# EAGLE schematic Z05_CC_SHIELD_02 (EAGLE 6.3)
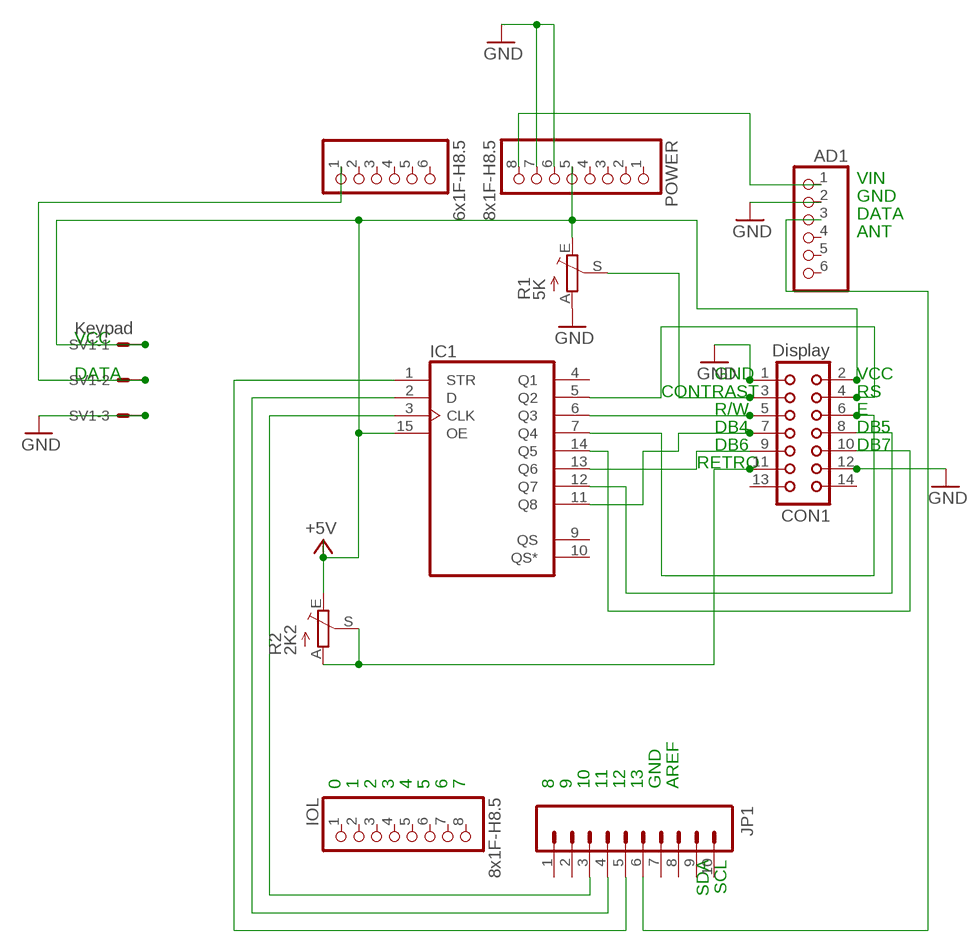
[diagram p0: schematic, sheet 1]

## Parts
AD  6x1F-H8.5  PINHD-1X6  [1X06]
AD1  6x1F-H8.5  PINHD-1X6  [1X06]
CON1  Display  CON14  [CON14]
IC1  4094N  [DIL16]
IOL  8x1F-H8.5  PINHD-1X8  [1X08]
JP1  M10"  [1X10]
POWER  8x1F-H8.5  PINHD-1X8  [1X08]
R1  5K  TRIM_EU-LI10  [LI10]
R2  2K2  TRIM_EU-LI10  [LI10]
SV1  Keypad  22-05-7058-05  [7395-05]

## Nets
+5V [usbvcc]: CON1.2 IC1.15(OE) POWER.5 R1.E R2.E SV1.1
A5: AD.1 SV1.2
GND [gnd]: AD1.2 CON1.1 CON1.12 POWER.6 POWER.7 R1.A SV1.3
N$1: CON1.11 R2.A R2.S
N$3: AD1.3 JP1.6
N$4: CON1.3 R1.S
N$5: IC1.1(STR) JP1.5
N$6: IC1.2(D) JP1.4
N$7: IC1.3(CLK) JP1.3
N$8: CON1.4 IC1.5(Q2)
N$9: CON1.5 IC1.6(Q3)
N$10: CON1.6 IC1.7(Q4)
N$11: CON1.7 IC1.11(Q8)
N$12: CON1.8 IC1.12(Q7)
N$13: CON1.9 IC1.13(Q6)
N$14: CON1.10 IC1.14(Q5)
VIN: AD1.1 POWER.8
Unconnected: AD1.4 AD1.5 AD1.6 AD.2 AD.3 AD.4 AD.5 AD.6 CON1.13 CON1.14 IC1.4(Q1) IC1.9(QS) IC1.10(QS*) IOL.1 IOL.2 IOL.3 IOL.4 IOL.5 IOL.6 IOL.7 IOL.8 JP1.1 JP1.2 JP1.7 JP1.8 JP1.9 JP1.10 POWER.1 POWER.2 POWER.3 POWER.4 SV1.4 SV1.5

## Notes on the sheet
- VIN
- GND
- DATA
- ANT
- VCC
- DATA | GND | VCC
- CONTRAST | RS
- R/W | E
- DB4 | DB5
- DB6 | DB7
- RETRO
- 0 | 1 | 2 | 3 | 4 | 5 | 6 | 7 | 8 | 9 | 10 | 11 | 12 | 13 | GND | AREF
- SDA | SCL

## Power pins joined to a net without a drawn wire
VDD: IC1.16(VDD)
VSS: IC1.8(VSS)

## Library data of the parts
AD AD1 = SmartPrj:PINHD-1X6: PIN HEADER
CON1 = con-harting:CON14: CONNECTOR; OC_FARNELL: unknown; OC_NEWARK: unknown
IC1 = 40xx:4094: 8-stage SHIFT/STORE REGISTER, tri-state
IOL POWER = SmartPrj:PINHD-1X8: PIN HEADER
JP1 = SparkFun-Connectors:M10: Header 10 Standard 10-pin 0.1" header. Use with straight break away headers (SKU : PRT-00116), right angle break away headers (PRT-00553), swiss pins (PRT-00743), machine pins (PRT-00117), and female headers (PRT-00115).
R1 R2 = pot:TRIM_EU-: POTENTIOMETER
SV1 = con-molex:22-?-05: CONNECTOR wire to board 2.54 mm (.1 inch) pitch header; OC_FARNELL: unknown; OC_NEWARK: unknown

## Net classes
0 default: width 0.254 mm, clearance 0.254 mm
1 power: width 0.61 mm, drill 0.61 mm, clearance 0.254 mm
2 gnd: width 0.305 mm, drill 0.559 mm, clearance 0.254 mm
3 usbvcc: width 0.406 mm, drill 0.508 mm, clearance 0.254 mm
4 aref: width 0.406 mm, drill 0.61 mm, clearance 0.254 mm